# Altium project Senior_Design_PCB.PrjPcb
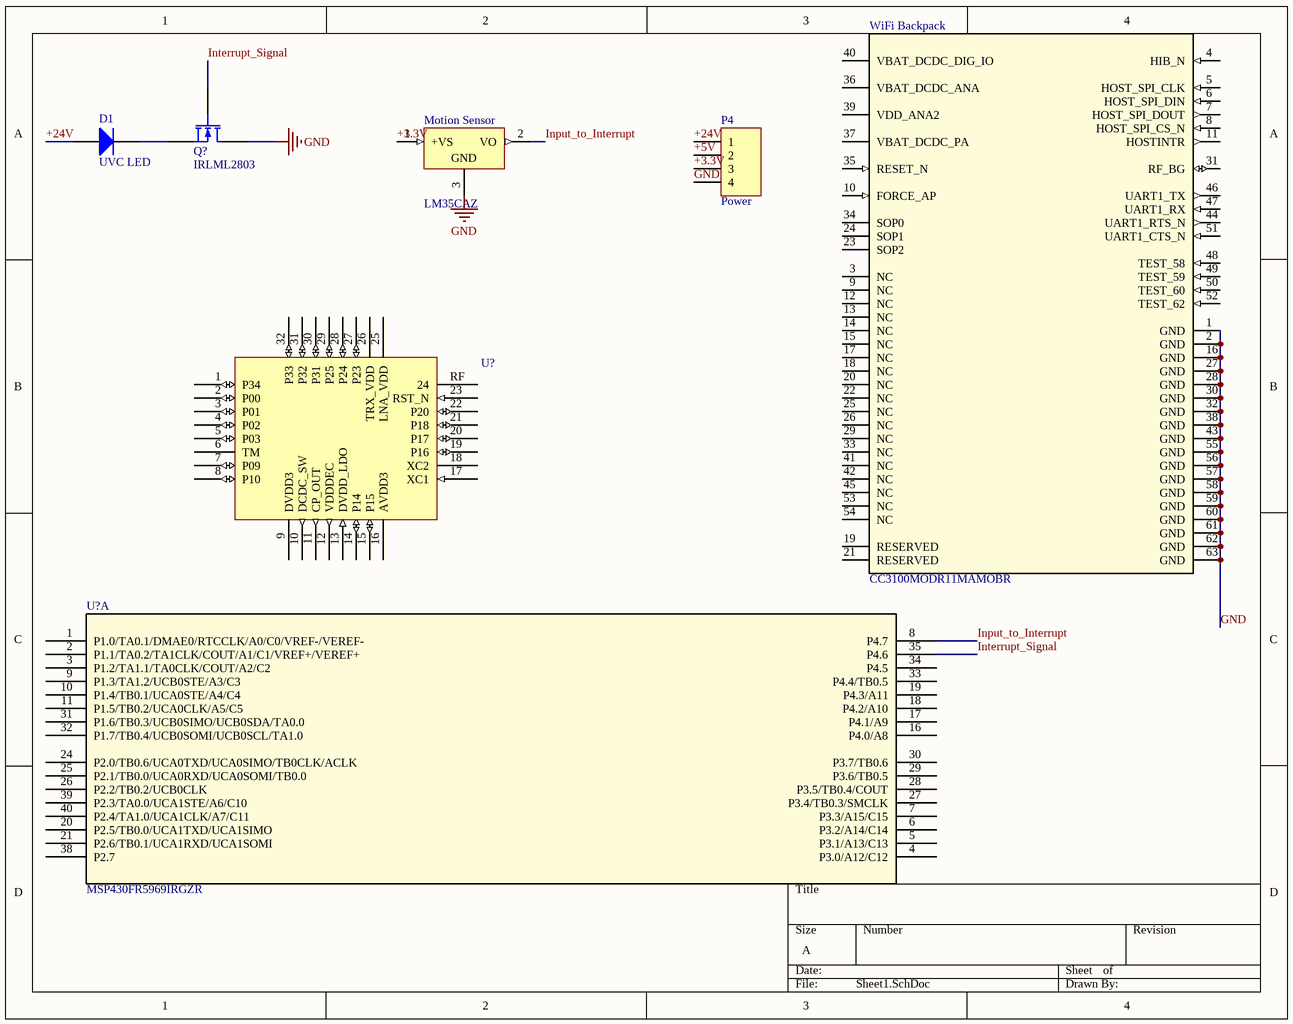
[diagram p0: Sheet1.SchDoc]
1 sheet, 7 parts. Net scope: global (net labels, ports and power ports of the same name join across sheets).

## Sheet Sheet1.SchDoc
size A; SheetNumber: 1; SheetTotal: 1

### Parts
(Parts that share a designator on the sheet are numbered #1, #2 ... from top to bottom, then left to right.)
D1  UVC LED  [SMC]
Motion_Sensor  LM35CAZ  [TO92C]
P4  Power  [USB-B]
Q?  IRLML2803  [SO-G3]
U?#1  CMT4502  (value not drawn)
U?#2  MSP430FR5969IRGZR  [RGZ48_4P1X4P1]  (part A of 2)
WiFi_Backpack  CC3100MODR11MAMOBR  [MOB0063A]

### Nets
GND: Motion_Sensor.3(GND) P4.4 Q?.3(D) WiFi_Backpack.1(GND) WiFi_Backpack.2(GND) WiFi_Backpack.16(GND) WiFi_Backpack.27(GND) WiFi_Backpack.28(GND) WiFi_Backpack.30(GND) WiFi_Backpack.32(GND) WiFi_Backpack.38(GND) WiFi_Backpack.43(GND) WiFi_Backpack.55(GND) WiFi_Backpack.56(GND) WiFi_Backpack.57(GND) WiFi_Backpack.58(GND) WiFi_Backpack.59(GND) WiFi_Backpack.60(GND) WiFi_Backpack.61(GND) WiFi_Backpack.62(GND) WiFi_Backpack.63(GND)
+3.3V: Motion_Sensor.1(+VS) P4.3
+5V: P4.2
+24V: D1.1(A) P4.1
Input_to_Interrupt: Motion_Sensor.2(VO) U?#2.8(P4.7)
Interrupt_Signal: Q?.1(G) U?#2.35(P4.6)
NetD1_2: D1.2(K) Q?.2(S)

Not connected (* = marked no-connect by the designer): U?#1 1(P34) 2(P00) 3(P01) 4(P02) 5(P03) 6(TM) 7(P09) 8(P10) 9(DVDD3) 10(DCDC_SW) 11(CP_OUT) 12(VDDDEC) 13(DVDD_LDO) 14(P14) 15(P15) 16(AVDD3) 17(XC1) 18(XC2) 19(P16) 20(P17) 21(P18) 22(P20) 23(RST_N) 25(LNA_VDD) 26(TRX_VDD) 27(P23) 28(P24) 29(P25) 30(P31) 31(P32) 32(P33) RF(24); U?#2 1(P1.0/TA0.1/DMAE0/RTCCLK/A0/C0/VREF-/VEREF-) 2(P1.1/TA0.2/TA1CLK/COUT/A1/C1/VREF+/VEREF+) 3(P1.2/TA1.1/TA0CLK/COUT/A2/C2) 4(P3.0/A12/C12) 5(P3.1/A13/C13) 6(P3.2/A14/C14) 7(P3.3/A15/C15) 9(P1.3/TA1.2/UCB0STE/A3/C3) 10(P1.4/TB0.1/UCA0STE/A4/C4) 11(P1.5/TB0.2/UCA0CLK/A5/C5) 16(P4.0/A8) 17(P4.1/A9) 18(P4.2/A10) 19(P4.3/A11) 20(P2.5/TB0.0/UCA1TXD/UCA1SIMO) 21(P2.6/TB0.1/UCA1RXD/UCA1SOMI) 24(P2.0/TB0.6/UCA0TXD/UCA0SIMO/TB0CLK/ACLK) 25(P2.1/TB0.0/UCA0RXD/UCA0SOMI/TB0.0) 26(P2.2/TB0.2/UCB0CLK) 27(P3.4/TB0.3/SMCLK) 28(P3.5/TB0.4/COUT) 29(P3.6/TB0.5) 30(P3.7/TB0.6) 31(P1.6/TB0.3/UCB0SIMO/UCB0SDA/TA0.0) 32(P1.7/TB0.4/UCB0SOMI/UCB0SCL/TA1.0) 33(P4.4/TB0.5) 34(P4.5) 38(P2.7) 39(P2.3/TA0.0/UCA1STE/A6/C10) 40(P2.4/TA1.0/UCA1CLK/A7/C11); WiFi_Backpack 3(NC) 4(HIB_N) 5(HOST_SPI_CLK) 6(HOST_SPI_DIN) 7(HOST_SPI_DOUT) 8(HOST_SPI_CS_N) 9(NC) 10(FORCE_AP) 11(HOSTINTR) 12(NC) 13(NC) 14(NC) 15(NC) 17(NC) 18(NC) 19(RESERVED) 20(NC) 21(RESERVED) 22(NC) 23(SOP2) 24(SOP1) 25(NC) 26(NC) 29(NC) 31(RF_BG) 33(NC) 34(SOP0) 35(RESET_N) 36(VBAT_DCDC_ANA) 37(VBAT_DCDC_PA) 39(VDD_ANA2) 40(VBAT_DCDC_DIG_IO) 41(NC) 42(NC) 44(UART1_RTS_N) 45(NC) 46(UART1_TX) 47(UART1_RX) 48(TEST_58) 49(TEST_59) 50(TEST_60) 51(UART1_CTS_N) 52(TEST_62) 53(NC) 54(NC)

### Library data of the parts
D1 = Diode: Default Diode; Published: 8-Jun-2000; LatestRevisionDate: 17-Jul-2002; LatestRevisionNote: Re-released for DXP Platform.; PackageVersion: Sep-1996; PackageReference: SMC; Publisher: Altium Limited; PackageDescription: DO-214-AB/SMC; 2 C-Bend Leads; Body 7.9 x 5.9 mm, inc. leads (LxW); Code_JEDEC: DO-214-AB
Motion_Sensor = LM35CAZ: Precision Centigrade Temperature Sensor, 3-pin TO-92; Manufacturer: National Semiconductor; PackageTopMarking: NSXYTT*LM35*CAZ; PowerWise: N; CompType: Temp Sensor IC; Published: 4-Dec-2008; LatestRevisionDate: 15-Jul-2009; LatestRevisionNote: Sch pins 1 & 3 reversed.; DatasheetVersion: Nov-2000; PackageVersion: revG, Sep-2000; PackageReference: Z03A; Publisher: Altium Limited; PackageDescription: TO-92, Molded, 3 Lead; Supplier 1: Farnell; Supplier Part Number 1: 9494529; PartNumber: LM35CAZ; RoHS: N; PinCount: 3; Code_JEDEC: TO-226-AA; ComponentLink1Description: LM35 Datasheet; ComponentLink1URL: http://www.national.com/ds/LM/LM35.pdf; ComponentLink2Description: LM35 Web Page; ComponentLink2URL: http://www.national.com/pf/LM/LM35.html; ComponentLink3Description: Z03A Package Page; ComponentLink3URL: http://www.national.com/packaging/folders/z03a.html
P4 = Header 4: 4 Pin Header; LatestRevisionDate: 17-Jul-2002; LatestRevisionNote: Re-released for DXP Platform.; Publisher: Altium Limited
Q? = MOSFET-N: N-Channel MOSFET; Published: 8-Jun-2000; Revision: July-2002: Re-released for DXP Platform.; Publisher: Altium Limited
U?#1 = CMT4502: Bluetooth Receiver; ComponentLink1Description: https://www.microchip.ua/wireless/cmt4502.pdf; ComponentLink1URL: *
U?#2 = MSP430FR5969IRGZR: No Description Available; Mfr_Name: Texas Instruments; Copyright: Copyright (C) 2022 Ultra Librarian. All rights reserved.; Manufacturer_Part_Number: MSP430FR5969IRGZR; RefDes: RefDes; Type: DEV
WiFi_Backpack = CC3100MODR11MAMOBR: No Description Available; Mfr_Name: Texas Instruments; Alternate_PartNumber: CC3100MODR11MAMOBT; CompType: IC; Type: DEV; RefDes: RefDes; Copyright: Copyright (C) 2022 Ultra Librarian. All rights reserved.; Manufacturer_Part_Number: CC3100MODR11MAMOBR; PartNumber: CC3100MODR11MAMOBR; PackageReference: MOB0063A; MountType: SMT; RoHS: Y; Manufacturer: Texas Instruments